# Altium schematic sheet Main.SchDoc
size A3
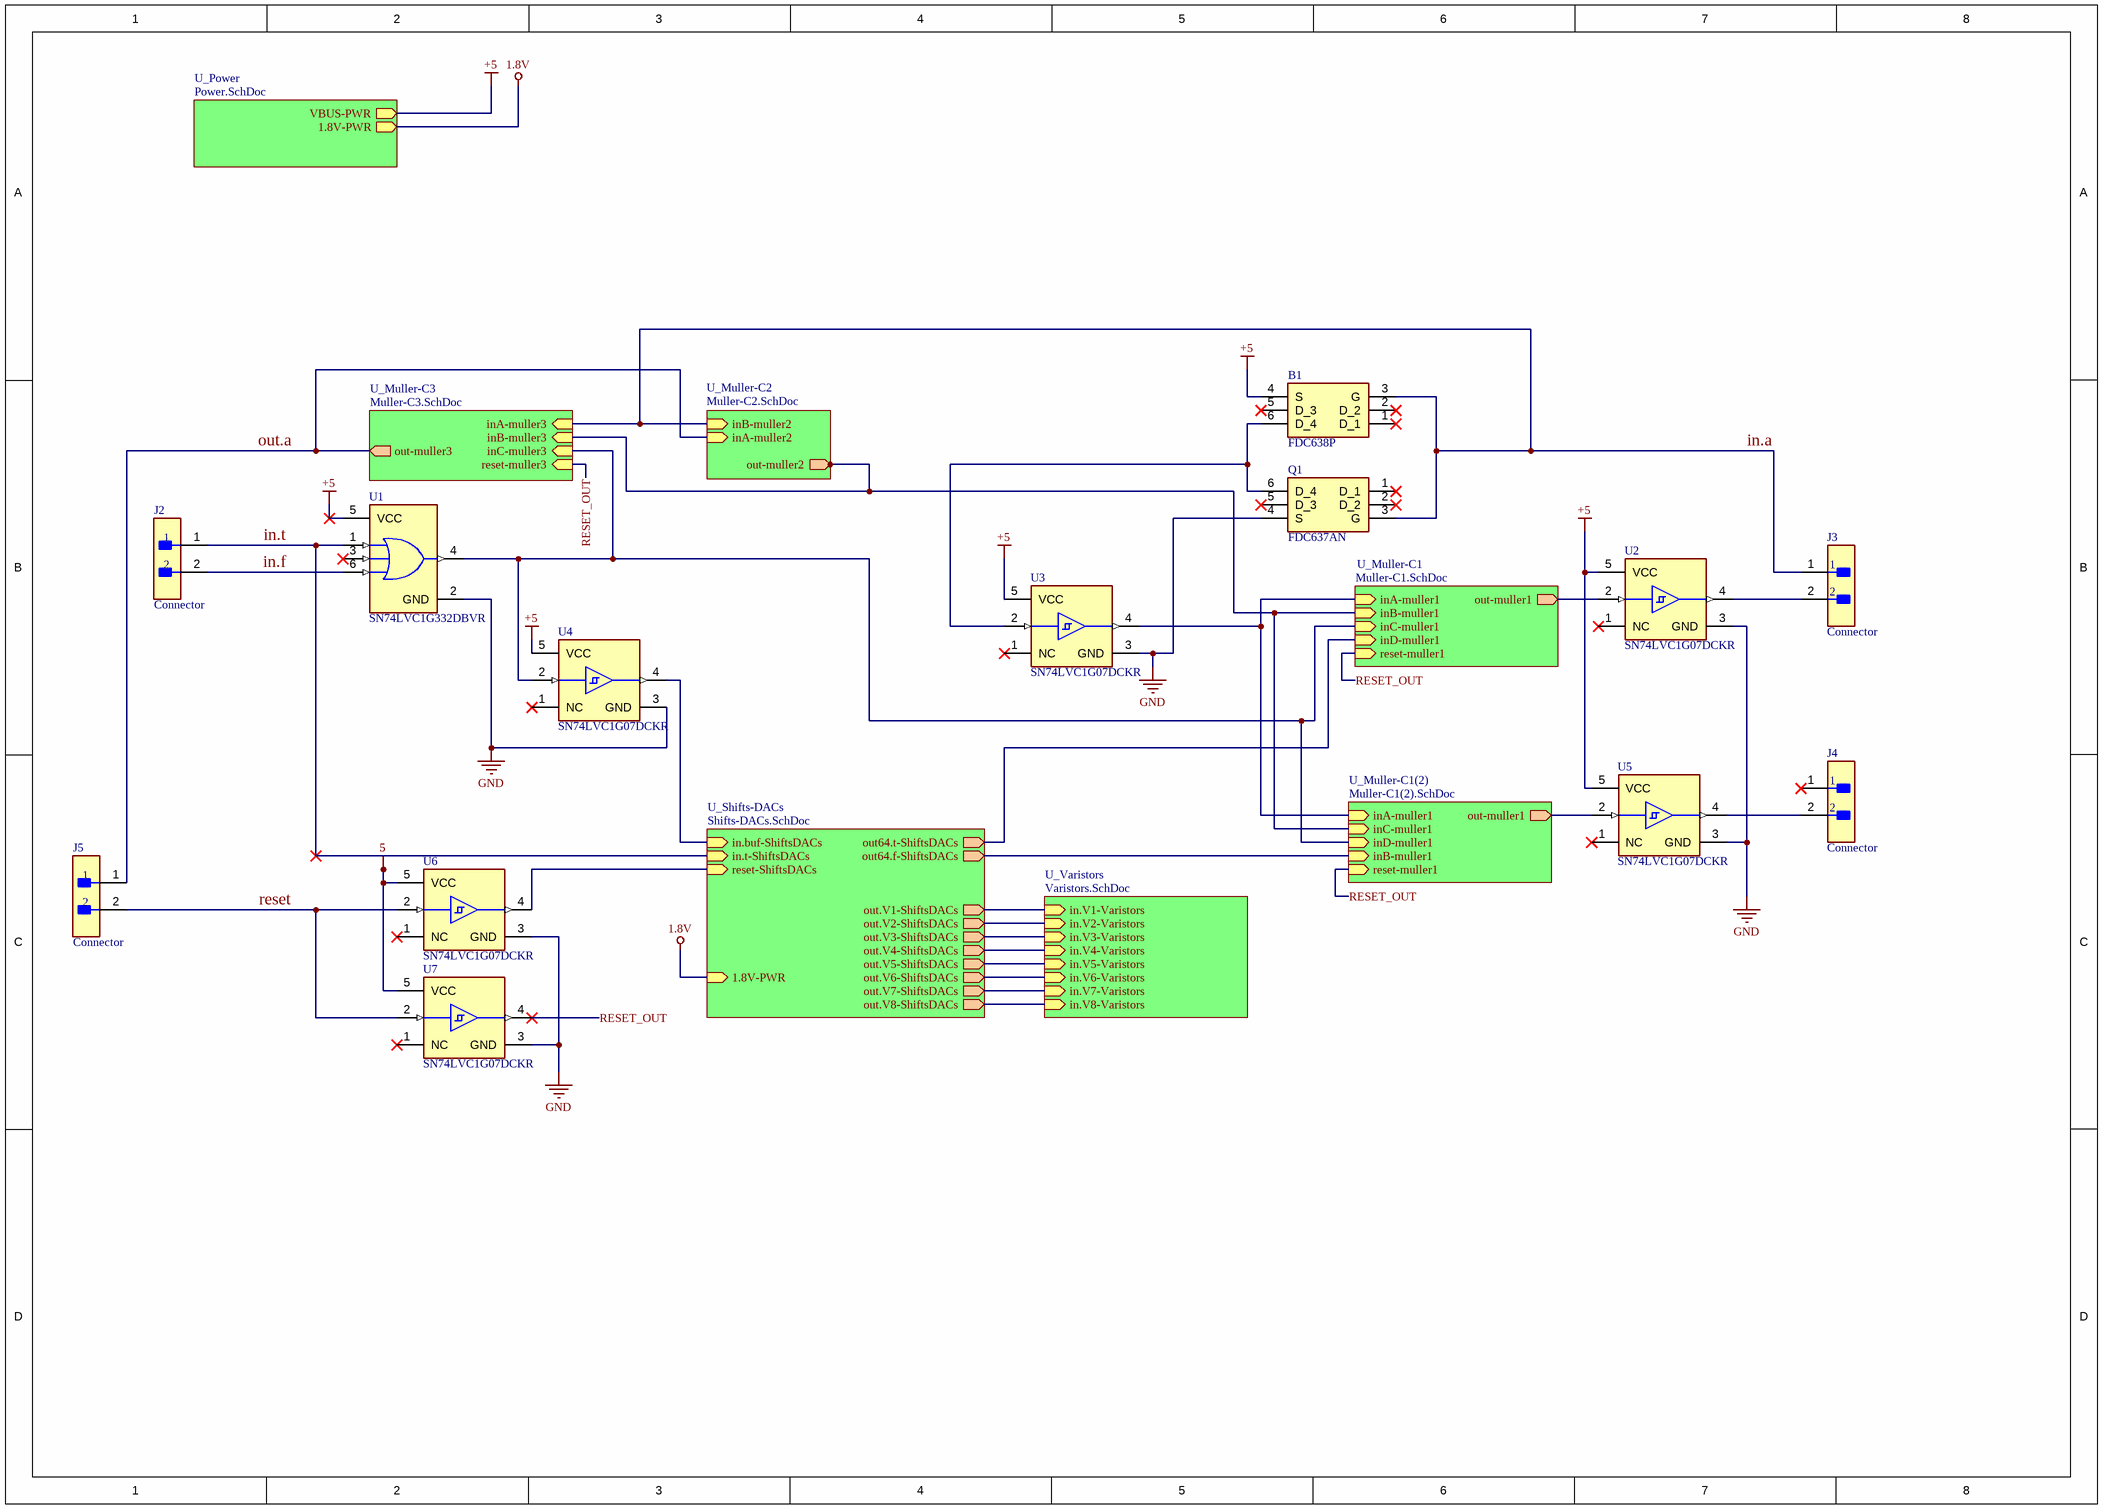
[diagram p0: Main.SchDoc]

## Parts
B1  FDC638P  [SOT95P275X110-6N]
J2  Connector  [FP-B2B-XH-A_LF_SN-MFG]
J3  Connector  [FP-B2B-XH-A_LF_SN-MFG]
J4  Connector  [FP-B2B-XH-A_LF_SN-MFG]
J5  Connector  [FP-B2B-XH-A_LF_SN-MFG]
Q1  FDC637AN  [SOT95P275X110-6N]
U1  SN74LVC1G332DBVR  [FP-DBV0006A-MFG]
U2  SN74LVC1G07DCKR  [FP-DCK0005A-MFG]
U3  SN74LVC1G07DCKR  [FP-DCK0005A-MFG]
U4  SN74LVC1G07DCKR  [FP-DCK0005A-MFG]
U5  SN74LVC1G07DCKR  [FP-DCK0005A-MFG]
U6  SN74LVC1G07DCKR  [FP-DCK0005A-MFG]
U7  SN74LVC1G07DCKR  [FP-DCK0005A-MFG]

## Sub-sheets
U_Muller-C1 = Muller-C1.SchDoc: out-muller1 (out), inA-muller1 (in), inB-muller1 (in), inC-muller1 (in), inD-muller1 (in), reset-muller1 (in)
U_Muller-C1(2) = Muller-C1(2).SchDoc: out-muller1 (out), inA-muller1 (in), inC-muller1 (in), inD-muller1 (in), inB-muller1 (in), reset-muller1 (in)
U_Muller-C2 = Muller-C2.SchDoc: out-muller2 (out), inB-muller2 (in), inA-muller2 (in)
U_Muller-C3 = Muller-C3.SchDoc: inA-muller3 (in), inB-muller3 (in), inC-muller3 (in), out-muller3 (out), reset-muller3 (in)
U_Power = Power.SchDoc: VBUS-PWR (out), 1.8V-PWR (out)
U_Shifts-DACs = Shifts-DACs.SchDoc: in.t-ShiftsDACs (in), in.buf-ShiftsDACs (in), reset-ShiftsDACs (in), out64.t-ShiftsDACs (out), out64.f-ShiftsDACs (out), out.V1-ShiftsDACs (out), out.V2-ShiftsDACs (out), out.V3-ShiftsDACs (out), out.V4-ShiftsDACs (out), out.V5-ShiftsDACs (out), out.V6-ShiftsDACs (out), out.V7-ShiftsDACs (out), out.V8-ShiftsDACs (out), 1.8V-PWR (in)
U_Varistors = Varistors.SchDoc: in.V1-Varistors (in), in.V2-Varistors (in), in.V3-Varistors (in), in.V4-Varistors (in), in.V5-Varistors (in), in.V6-Varistors (in), in.V7-Varistors (in), in.V8-Varistors (in)

## Nets
1.8V: sheet U_Shifts-DACs/1.8V-PWR, sheet U_Power/1.8V-PWR
5: U6.5(VCC) U7.5(VCC)
+5: B1.4(S) U1.5(VCC) U2.5(VCC) U3.5(VCC) U4.5(VCC) U5.5(VCC) ; sheet U_Power/VBUS-PWR
GND: Q1.4(S) U1.2(GND) U2.3(GND) U3.3(GND) U4.3(GND) U5.3(GND) U6.3(GND) U7.3(GND)
in.a: B1.3(G) J3.1 Q1.3(G) ; sheet U_Muller-C2/inB-muller2, sheet U_Muller-C3/inA-muller3
in.f: J2.2 U1.6(C)
in.t: J2.1 U1.1(A) ; sheet U_Shifts-DACs/in.t-ShiftsDACs
out.a: J5.1 ; sheet U_Muller-C2/inA-muller2, sheet U_Muller-C3/out-muller3
reset: J5.2 U6.2(A) U7.2(A)
RESET_OUT: U7.4(Y) ; sheet U_Muller-C1/reset-muller1, sheet U_Muller-C3/reset-muller3, sheet U_Muller-C1(2)/reset-muller1
NetB1_6: B1.6(D_4) Q1.6(D_4) U3.2(A)
NetJ3_2: J3.2 U2.4(Y)
NetJ4_2: J4.2 U5.4(Y)
NetU1_4: U1.4(Y) U4.2(A) ; sheet U_Muller-C1/inC-muller1, sheet U_Muller-C3/inC-muller3, sheet U_Muller-C1(2)/inD-muller1
NetU2_2: U2.2(A) ; sheet U_Muller-C1/out-muller1
NetU3_4: U3.4(Y) ; sheet U_Muller-C1/inA-muller1, sheet U_Muller-C1(2)/inA-muller1
NetU4_4: U4.4(Y) ; sheet U_Shifts-DACs/in.buf-ShiftsDACs
NetU5_2: U5.2(A) ; sheet U_Muller-C1(2)/out-muller1
NetU6_4: U6.4(Y) ; sheet U_Shifts-DACs/reset-ShiftsDACs
(unnamed): sheet U_Muller-C1/inB-muller1, sheet U_Muller-C2/out-muller2, sheet U_Muller-C3/inB-muller3, sheet U_Muller-C1(2)/inC-muller1
(unnamed): sheet U_Muller-C1/inD-muller1, sheet U_Shifts-DACs/out64.t-ShiftsDACs
(unnamed): sheet U_Shifts-DACs/out64.f-ShiftsDACs, sheet U_Muller-C1(2)/inB-muller1
(unnamed): sheet U_Shifts-DACs/out.V1-ShiftsDACs, sheet U_Varistors/in.V1-Varistors
(unnamed): sheet U_Shifts-DACs/out.V2-ShiftsDACs, sheet U_Varistors/in.V2-Varistors
(unnamed): sheet U_Shifts-DACs/out.V3-ShiftsDACs, sheet U_Varistors/in.V3-Varistors
(unnamed): sheet U_Shifts-DACs/out.V4-ShiftsDACs, sheet U_Varistors/in.V4-Varistors
(unnamed): sheet U_Shifts-DACs/out.V5-ShiftsDACs, sheet U_Varistors/in.V5-Varistors
(unnamed): sheet U_Shifts-DACs/out.V6-ShiftsDACs, sheet U_Varistors/in.V6-Varistors
(unnamed): sheet U_Shifts-DACs/out.V7-ShiftsDACs, sheet U_Varistors/in.V7-Varistors
(unnamed): sheet U_Shifts-DACs/out.V8-ShiftsDACs, sheet U_Varistors/in.V8-Varistors

Not connected (* = marked no-connect by the designer): B1 1(D_1)* 2(D_2)* 5(D_3)*; J4 1*; Q1 1(D_1)* 2(D_2)* 5(D_3)*; U1 3(B)*; U2 1(NC)*; U3 1(NC)*; U4 1(NC)*; U5 1(NC)*; U6 1(NC)*; U7 1(NC)*

## Library data of the parts
B1 = CMP-007-000000-1: Low gate charge (10 nC typical); Manufacturer_Name: onsemi; Geometry.Height: 1.1mm; Datasheet Link: https://www.onsemi.com/pub/Collateral/FDC638P-D.PDF; Arrow Price/Stock: *; Design Item ID: FDC638P; Mouser Part Number: 512-FDC638P; Manufacturer_Part_Number: FDC638P; Mouser Price/Stock: https://www.mouser.co.uk/ProductDetail/onsemi-Fairchild/FDC638P?qs=FOlmdCx%252BAA16kOuf%252Brkheg%3D%3D; Source: FDC638P.SchLib; Arrow Part Number: *
J2-J5 = CMP-2000-05888-3: B2B-XH-A(LF)(SN) CONN HEADER VERT 2POS 2.5MM; Current Rating: 3A; Voltage Rating: 250V; Number of Contacts: 2; Contact Resistance: 20mR; Wire/Cable Gauge: 22AWG; Insulation Resistance: 1GR; Connector Type: Male Pin; Packaging: Bulk; Contact Material: Brass; Lead Free: Lead Free; Orientation: Straight; Contact Plating: Tin; Max Current Rating: 3A; Termination: Solder; Fastening Type: Detent; Depth: 5.75mm; Housing Material: Polyamide; REACH SVHC: No SVHC; Series: XH; Voltage Rating (AC): 250V; Number of Positions: 2; Color: Natural; Contact Type: Male Pin; Max Voltage Rating (DC): 250V; Pitch: 2.5mm; Lead Pitch: 2.5mm; Mount: Through Hole; Max Operating Temperature: 85°C; Length: 7.4mm; Max Voltage Rating (AC): 250V; Min Operating Temperature: -25°C; Number of Rows: 1; Housing Color: White
Q1 = CMP-005-000000-4: Low gate charge (10.5nC typical).; Manufacturer_Name: onsemi; Geometry.Height: 1.1mm; Mouser Part Number: 512-FDC637AN; Source: FDC637AN.SchLib; Arrow Part Number: FDC637AN; Datasheet Link: https://www.onsemi.com/pub/Collateral/FDC637AN-D.PDF; Arrow Price/Stock: https://www.arrow.com/en/products/fdc637an/on-semiconductor?region=nac; Manufacturer_Part_Number: FDC637AN; Mouser Price/Stock: https://www.mouser.co.uk/ProductDetail/ON-Semiconductor-Fairchild/FDC637AN?qs=utFvTgNEmG6iAEUdTAueXw%3D%3D; Design Item ID: FDC637AN
U1 = CMP-0859-00188-4: IC GATE OR 1CH 3-INP SOT23-6; Manufacturer: TEXAS INSTRUMENTS; Number Of Inputs: 3; Nominal Supply Current: 10-500uA; Number Of Circuits: 1; Max Supply Voltage: 5.5V; Standoff Height: 0mm; Propagation Delay: 4.5ns; Min Supply Voltage: 1.5V; Height: 1.45mm; Temperature Range High: +125°C; Device Class L3: Logic Gates; Device Class L2: Logic ICs; Lead Free: Yes; Temperature Range Low: -40°C; ComponentLink2URL: http://www.ti.com/lit/ds/symlink/sn74lvc1g332.pdf; Package: DBV0006A; ComponentLink2Description: Datasheet; Octopart: https://octopart.com/sn74lvc1g332dbvr-texas+instruments-464996; Category: IC; Automotive: No; Manufacturer Part Number: SN74LVC1G332DBVR; Ipc Land Pattern Name: SOT95P280X145-6; Logic Function Desc: OR; Ambient Temperature Range Low: -40°C; Temperature: -40°C to +125°C; Number Of Outputs: 1; Mouser Description: Logic Gates Sngl 3 Inpt + OR Gt; RoHS: TRUE; Ambient Temperature Range High: +125°C; Device Class L1: Integrated Circuits (ICs); Digikey Description: IC GATE OR 1CH 3-INP SOT23-6
U2-U7 = CMP-00023-00004-1: Buffer, LVC/LCX/Z Series, 1-Func, 1-Input, CMOS, PDSO5; Min Operating Temperature: -40°C; Pins: 5; Case/Package: TSSOP; Max Operating Temperature: 125°C; RoHS Compliant: Yes